# Altium schematic sheet CorePad-V2.0.SchDoc
size A2
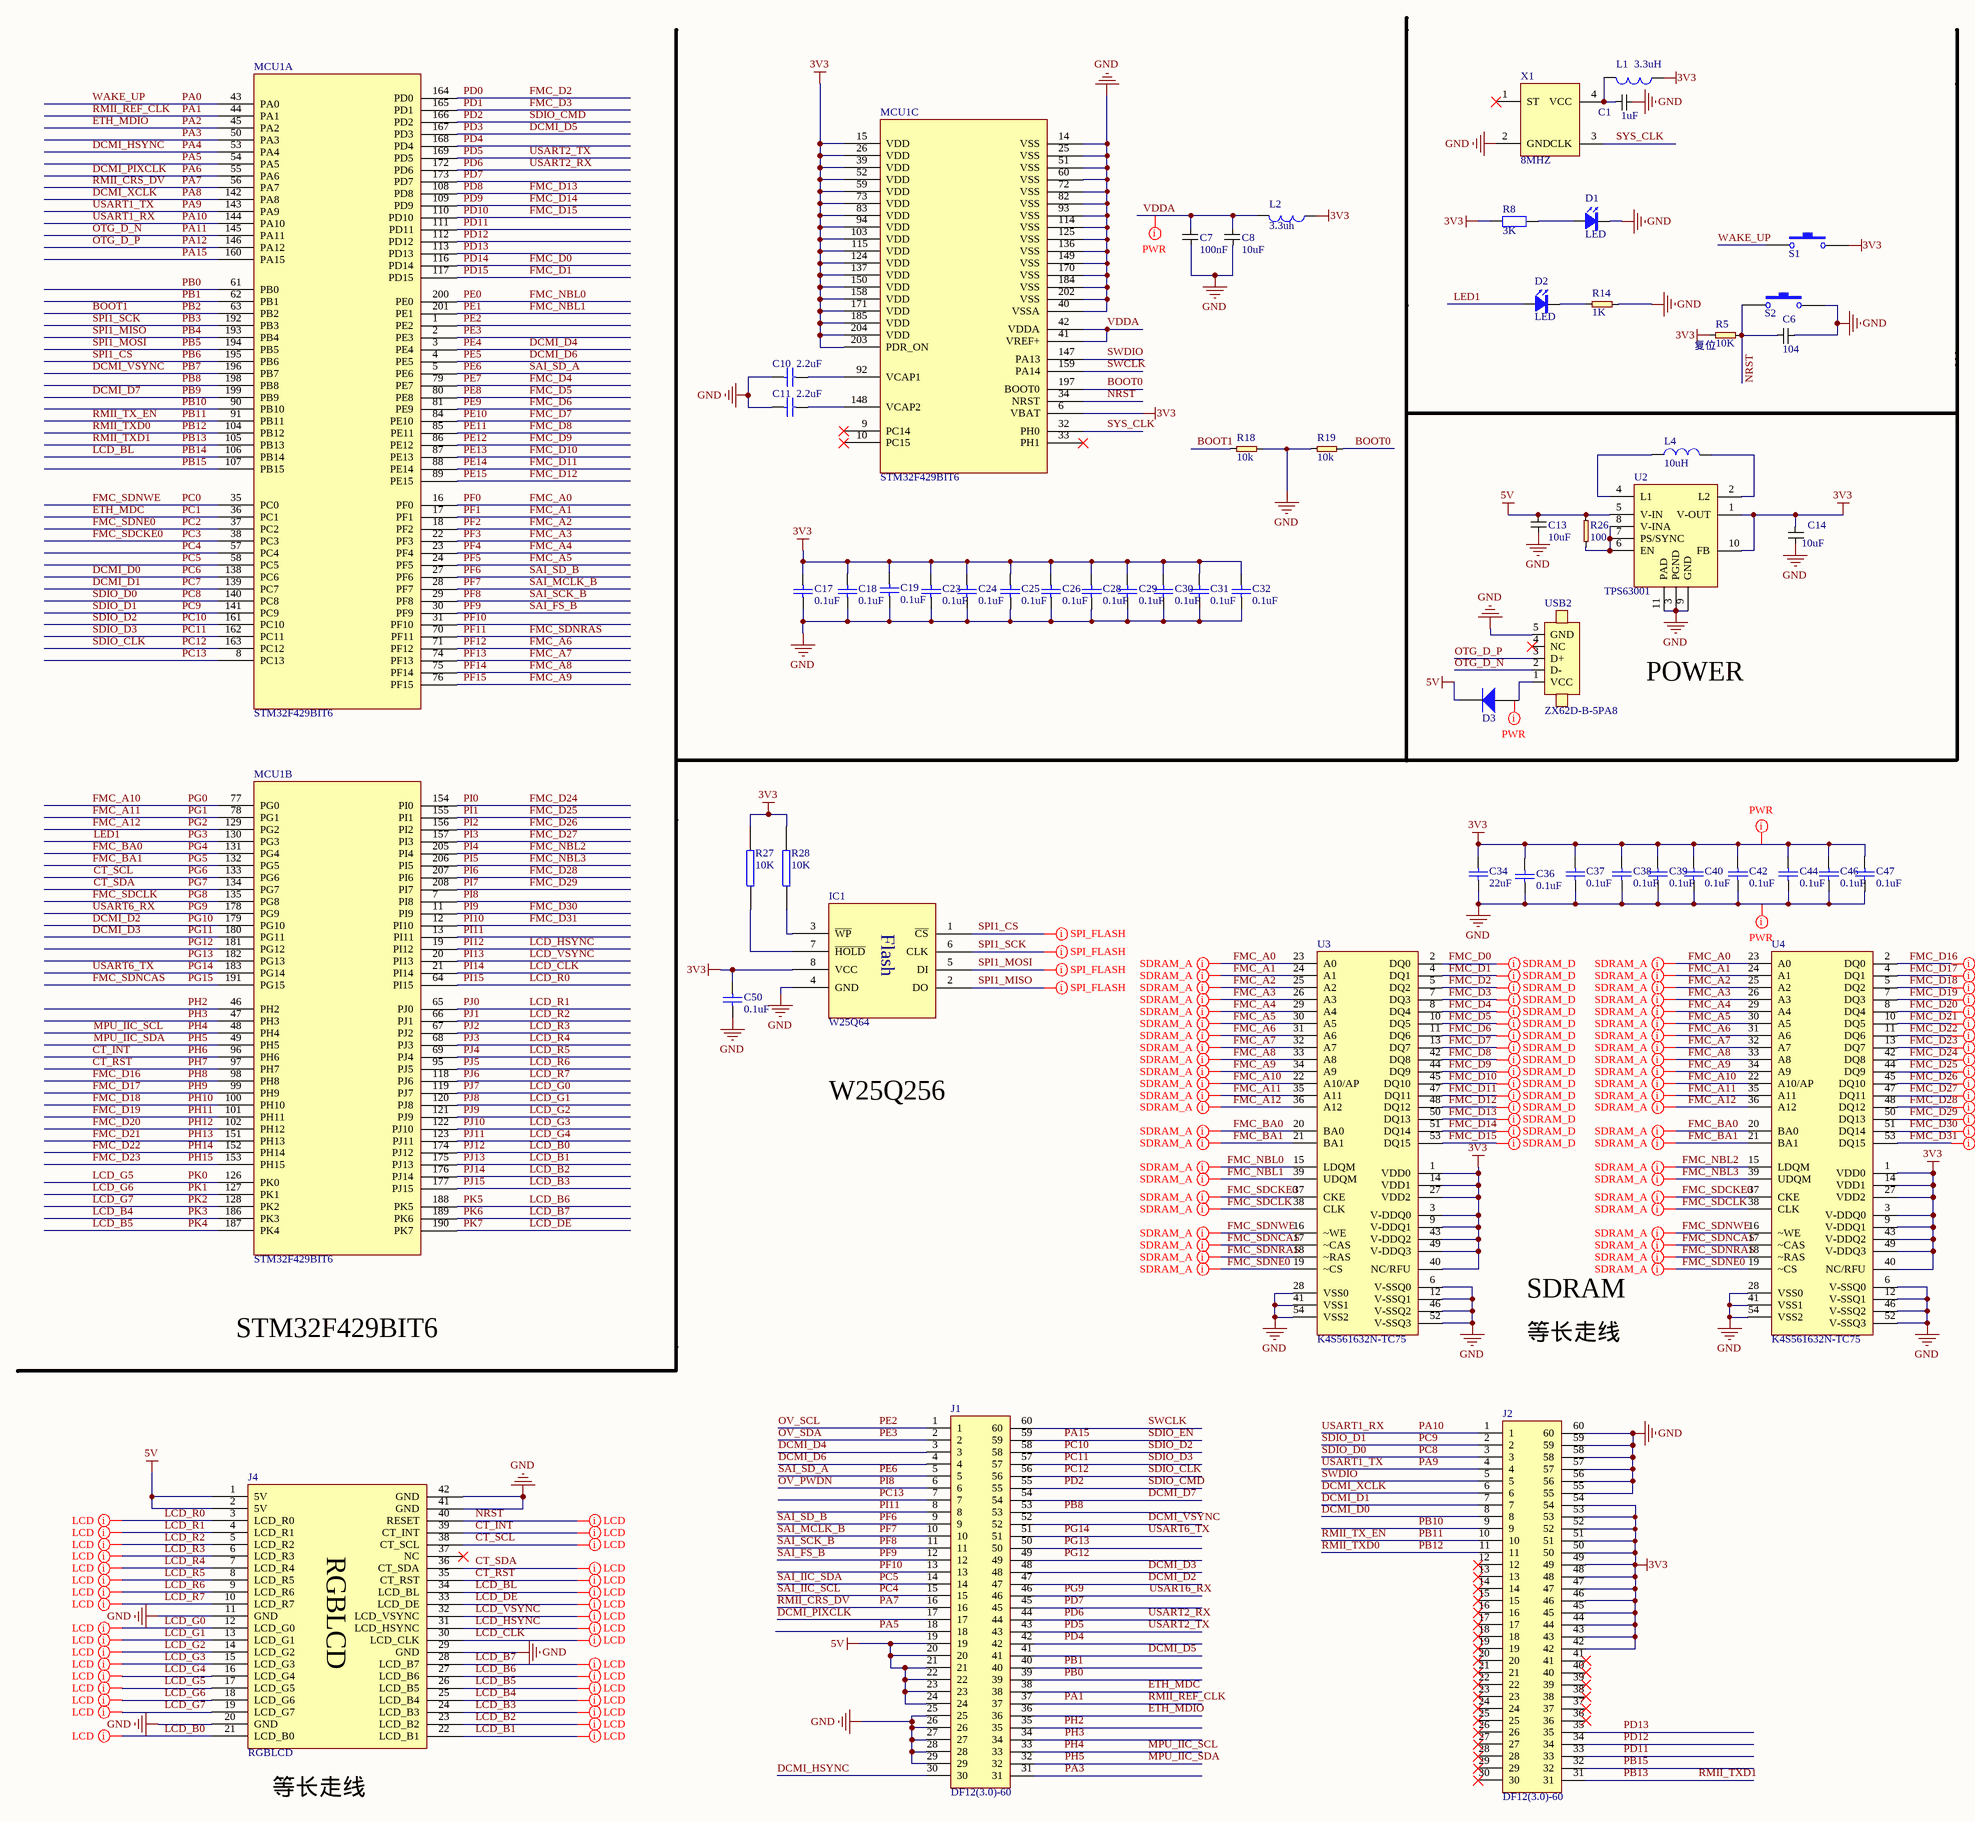
[diagram p0: CorePad-V2.0.SchDoc]

## Parts
C1  1uF  [0603_c]
C6  104  [0603_c]
C7  100nF  [0603_c]
C8  10uF  [0603_c]
C10  2.2uF  [0603_c]
C11  2.2uF  [0603_c]
C13  10uF  [0603_c]
C14  10uF  [0603_c]
C17  0.1uF  [0603_c]
C18  0.1uF  [0603_c]
C19  0.1uF  [0603_c]
C23  0.1uF  [0603_c]
C24  0.1uF  [0603_c]
C25  0.1uF  [0603_c]
C26  0.1uF  [0603_c]
C28  0.1uF  [0603_c]
C29  0.1uF  [0603_c]
C30  0.1uF  [0603_c]
C31  0.1uF  [0603_c]
C32  0.1uF  [0603_c]
C34  22uF  [0603_c]
C36  0.1uF  [0603_c]
C37  0.1uF  [0603_c]
C38  0.1uF  [0603_c]
C39  0.1uF  [0603_c]
C40  0.1uF  [0603_c]
C42  0.1uF  [0603_c]
C44  0.1uF  [0603_c]
C46  0.1uF  [0603_c]
C47  0.1uF  [0603_c]
C50  0.1uF  [0603_c]
D1  LED  [D0603-B]
D2  LED  [D0603-B]
D3  1N5819  [SOD123]  (value not drawn)
IC1  W25Q64  [SOIC-W-8]
J1  DF12(3.0)-60  [DF12(3.0)-60DS]
J2  DF12(3.0)-60  [DF12(3.0)-60DS]
J4  RGBLCD  [FPC_0.5MM_40P]
L1  3.3uH  [0603_R]
L2  3.3uh  [0603_R]
L4  10uH  [L-SMD]
MCU1  STM32F429BIT6  [LQFP-208-0.5MM]  (parts A,B,C of 3)
R5  10K  [0603_R]
R8  3K  [0603_R]
R14  1K  [0603_R]
R18  10k  [0603_R]
R19  10k  [0603_R]
R26  100  [0603_R]
R27  10K  [0603_R]
R28  10K  [0603_R]
S1  SW-PB  [SW-3625]  (value not drawn)
S2  SW-PB  [SW-3625]  (value not drawn)
U2  TPS63001  [QFN-10]
U3  K4S561632N-TC75  [TSOP54]
U4  K4S561632N-TC75  [TSOP54]
USB2  ZX62D-B-5PA8  [Micro_USB]
X1  8MHZ  [OSC]

## Nets
3V3: C14.2 C17.2 C18.2 C19.2 C23.2 C24.2 C25.2 C26.2 C28.2 C29.2 C30.2 C31.2 C32.2 C34.2 C36.2 C37.2 C38.2 C39.2 C40.2 C42.2 C44.2 C46.2 C47.2 C50.2 IC1.8(VCC) J2.42 J2.43 J2.44 J2.45 J2.46 J2.47 J2.48 J2.49 J2.50 J2.51 J2.52 J2.53 J2.54 L1.1 L2.1 MCU1.6(VBAT) MCU1.15(VDD) MCU1.26(VDD) MCU1.39(VDD) MCU1.52(VDD) MCU1.59(VDD) MCU1.73(VDD) MCU1.83(VDD) MCU1.94(VDD) MCU1.103(VDD) MCU1.115(VDD) MCU1.124(VDD) MCU1.137(VDD) MCU1.150(VDD) MCU1.158(VDD) MCU1.171(VDD) MCU1.185(VDD) MCU1.203(PDR_ON) MCU1.204(VDD) R5.1 R8.1 R27.2 R28.2 S1.2 U2.1(V-OUT) U2.10(FB) U3.1(VDD0) U3.3(V-DDQ0) U3.9(V-DDQ1) U3.14(VDD1) U3.27(VDD2) U3.40(NC/RFU) U3.43(V-DDQ2) U3.49(V-DDQ3) U4.1(VDD0) U4.3(V-DDQ0) U4.9(V-DDQ1) U4.14(VDD1) U4.27(VDD2) U4.40(NC/RFU) U4.43(V-DDQ2) U4.49(V-DDQ3)
5V: C13.2 D3.2(N) J1.19 J1.20 J1.21 J1.22 J1.23 J1.24 J4.1(5V) J4.2(5V) R26.2 U2.5(V-IN)
GND: C1.2 C6.2 C7.2 C8.2 C10.1 C11.1 C13.1 C14.1 C17.1 C18.1 C19.1 C23.1 C24.1 C25.1 C26.1 C28.1 C29.1 C30.1 C31.1 C32.1 C34.1 C36.1 C37.1 C38.1 C39.1 C40.1 C42.1 C44.1 C46.1 C47.1 C50.1 D1.K IC1.4(GND) J1.25 J1.26 J1.27 J1.28 J1.29 J2.55 J2.56 J2.57 J2.58 J2.59 J2.60 J4.11(GND) J4.20(GND) J4.29(GND) J4.41(GND) J4.42(GND) MCU1.14(VSS) MCU1.25(VSS) MCU1.40(VSSA) MCU1.51(VSS) MCU1.60(VSS) MCU1.72(VSS) MCU1.82(VSS) MCU1.93(VSS) MCU1.114(VSS) MCU1.125(VSS) MCU1.136(VSS) MCU1.149(VSS) MCU1.170(VSS) MCU1.184(VSS) MCU1.202(VSS) R14.2 R18.2 R19.1 S2.2 U2.3(PGND) U2.9(GND) U2.11(PAD) U3.6(V-SSQ0) U3.12(V-SSQ1) U3.28(VSS0) U3.41(VSS1) U3.46(V-SSQ2) U3.52(V-SSQ3) U3.54(VSS2) U4.6(V-SSQ0) U4.12(V-SSQ1) U4.28(VSS0) U4.41(VSS1) U4.46(V-SSQ2) U4.52(V-SSQ3) U4.54(VSS2) USB2.5(GND) X1.2(GND)
BOOT0: MCU1.197(BOOT0) R19.2
BOOT1: MCU1.63(PB2) R18.1  [also labelled PB2]
CT_INT: J4.39(CT_INT) MCU1.96(PH6)  [also labelled PH6]
CT_RST: J4.35(CT_RST) MCU1.97(PH7)  [also labelled PH7]
CT_SCL: J4.38(CT_SCL) MCU1.133(PG6)  [also labelled PG6]
CT_SDA: J4.36(CT_SDA) MCU1.134(PG7)  [also labelled PG7]
DCMI_D0: J2.8 MCU1.138(PC6)  [also labelled PC6]
DCMI_D1: J2.7 MCU1.139(PC7)  [also labelled PC7]
DCMI_D2: J1.47 MCU1.179(PG10)  [also labelled PG10]
DCMI_D3: J1.48 MCU1.180(PG11)  [also labelled PG11]
DCMI_D4: J1.3 MCU1.3(PE4)  [also labelled PE4]
DCMI_D5: J1.41 MCU1.167(PD3)  [also labelled PD3]
DCMI_D6: J1.4 MCU1.4(PE5)  [also labelled PE5]
DCMI_D7: J1.54 MCU1.199(PB9)  [also labelled PB9]
DCMI_HSYNC: J1.30 MCU1.53(PA4)  [also labelled PA4]
DCMI_PIXCLK: J1.17 MCU1.55(PA6)  [also labelled PA6]
DCMI_VSYNC: J1.52 MCU1.196(PB7)  [also labelled PB7]
DCMI_XCLK: J2.6 MCU1.142(PA8)  [also labelled PA8]
ETH_MDC: J1.38 MCU1.36(PC1)  [also labelled PC1]
ETH_MDIO: J1.36 MCU1.45(PA2)  [also labelled PA2]
FMC_A0: MCU1.16(PF0) U3.23(A0) U4.23(A0)  [also labelled PF0]
FMC_A1: MCU1.17(PF1) U3.24(A1) U4.24(A1)  [also labelled PF1]
FMC_A2: MCU1.18(PF2) U3.25(A2) U4.25(A2)  [also labelled PF2]
FMC_A3: MCU1.22(PF3) U3.26(A3) U4.26(A3)  [also labelled PF3]
FMC_A4: MCU1.23(PF4) U3.29(A4) U4.29(A4)  [also labelled PF4]
FMC_A5: MCU1.24(PF5) U3.30(A5) U4.30(A5)  [also labelled PF5]
FMC_A6: MCU1.71(PF12) U3.31(A6) U4.31(A6)  [also labelled PF12]
FMC_A7: MCU1.74(PF13) U3.32(A7) U4.32(A7)  [also labelled PF13]
FMC_A8: MCU1.75(PF14) U3.33(A8) U4.33(A8)  [also labelled PF14]
FMC_A9: MCU1.76(PF15) U3.34(A9) U4.34(A9)  [also labelled PF15]
FMC_A10: MCU1.77(PG0) U3.22(A10/AP) U4.22(A10/AP)  [also labelled PG0]
FMC_A11: MCU1.78(PG1) U3.35(A11) U4.35(A11)  [also labelled PG1]
FMC_A12: MCU1.129(PG2) U3.36(A12) U4.36(A12)  [also labelled PG2]
FMC_BA0: MCU1.131(PG4) U3.20(BA0) U4.20(BA0)  [also labelled PG4]
FMC_BA1: MCU1.132(PG5) U3.21(BA1) U4.21(BA1)  [also labelled PG5]
FMC_D0: MCU1.116(PD14) U3.2(DQ0)  [also labelled PD14]
FMC_D1: MCU1.117(PD15) U3.4(DQ1)  [also labelled PD15]
FMC_D2: MCU1.164(PD0) U3.5(DQ2)  [also labelled PD0]
FMC_D3: MCU1.165(PD1) U3.7(DQ3)  [also labelled PD1]
FMC_D4: MCU1.79(PE7) U3.8(DQ4)  [also labelled PE7]
FMC_D5: MCU1.80(PE8) U3.10(DQ5)  [also labelled PE8]
FMC_D6: MCU1.81(PE9) U3.11(DQ6)  [also labelled PE9]
FMC_D7: MCU1.84(PE10) U3.13(DQ7)  [also labelled PE10]
FMC_D8: MCU1.85(PE11) U3.42(DQ8)  [also labelled PE11]
FMC_D9: MCU1.86(PE12) U3.44(DQ9)  [also labelled PE12]
FMC_D10: MCU1.87(PE13) U3.45(DQ10)  [also labelled PE13]
FMC_D11: MCU1.88(PE14) U3.47(DQ11)  [also labelled PE14]
FMC_D12: MCU1.89(PE15) U3.48(DQ12)  [also labelled PE15]
FMC_D13: MCU1.108(PD8) U3.50(DQ13)  [also labelled PD8]
FMC_D14: MCU1.109(PD9) U3.51(DQ14)  [also labelled PD9]
FMC_D15: MCU1.110(PD10) U3.53(DQ15)  [also labelled PD10]
FMC_D16: MCU1.98(PH8) U4.2(DQ0)  [also labelled PH8]
FMC_D17: MCU1.99(PH9) U4.4(DQ1)  [also labelled PH9]
FMC_D18: MCU1.100(PH10) U4.5(DQ2)  [also labelled PH10]
FMC_D19: MCU1.101(PH11) U4.7(DQ3)  [also labelled PH11]
FMC_D20: MCU1.102(PH12) U4.8(DQ4)  [also labelled PH12]
FMC_D21: MCU1.151(PH13) U4.10(DQ5)  [also labelled PH13]
FMC_D22: MCU1.152(PH14) U4.11(DQ6)  [also labelled PH14]
FMC_D23: MCU1.153(PH15) U4.13(DQ7)  [also labelled PH15]
FMC_D24: MCU1.154(PI0) U4.42(DQ8)  [also labelled PI0]
FMC_D25: MCU1.155(PI1) U4.44(DQ9)  [also labelled PI1]
FMC_D26: MCU1.156(PI2) U4.45(DQ10)  [also labelled PI2]
FMC_D27: MCU1.157(PI3) U4.47(DQ11)  [also labelled PI3]
FMC_D28: MCU1.207(PI6) U4.48(DQ12)  [also labelled PI6]
FMC_D29: MCU1.208(PI7) U4.50(DQ13)  [also labelled PI7]
FMC_D30: MCU1.11(PI9) U4.51(DQ14)  [also labelled PI9]
FMC_D31: MCU1.12(PI10) U4.53(DQ15)  [also labelled PI10]
FMC_NBL0: MCU1.200(PE0) U3.15(LDQM)  [also labelled PE0]
FMC_NBL1: MCU1.201(PE1) U3.39(UDQM)  [also labelled PE1]
FMC_NBL2: MCU1.205(PI4) U4.15(LDQM)  [also labelled PI4]
FMC_NBL3: MCU1.206(PI5) U4.39(UDQM)  [also labelled PI5]
FMC_SDCKE0: MCU1.38(PC3) U3.37(CKE) U4.37(CKE)  [also labelled PC3]
FMC_SDCLK: MCU1.135(PG8) U3.38(CLK) U4.38(CLK)  [also labelled PG8]
FMC_SDNCAS: MCU1.191(PG15) U3.17(~CAS) U4.17(~CAS)  [also labelled PG15]
FMC_SDNE0: MCU1.37(PC2) U3.19(~CS) U4.19(~CS)  [also labelled PC2]
FMC_SDNRAS: MCU1.70(PF11) U3.18(~RAS) U4.18(~RAS)  [also labelled PF11]
FMC_SDNWE: MCU1.35(PC0) U3.16(~WE) U4.16(~WE)  [also labelled PC0]
LCD_B0: J4.21(LCD_B0) MCU1.174(PJ12)  [also labelled PJ12]
LCD_B1: J4.22(LCD_B1) MCU1.175(PJ13)  [also labelled PJ13]
LCD_B2: J4.23(LCD_B2) MCU1.176(PJ14)  [also labelled PJ14]
LCD_B3: J4.24(LCD_B3) MCU1.177(PJ15)  [also labelled PJ15]
LCD_B4: J4.25(LCD_B4) MCU1.186(PK3)  [also labelled PK3]
LCD_B5: J4.26(LCD_B5) MCU1.187(PK4)  [also labelled PK4]
LCD_B6: J4.27(LCD_B6) MCU1.188(PK5)  [also labelled PK5]
LCD_B7: J4.28(LCD_B7) MCU1.189(PK6)  [also labelled PK6]
LCD_BL: J4.34(LCD_BL) MCU1.106(PB14)  [also labelled PB14]
LCD_CLK: J4.30(LCD_CLK) MCU1.21(PI14)  [also labelled PI14]
LCD_DE: J4.33(LCD_DE) MCU1.190(PK7)  [also labelled PK7]
LCD_G0: J4.12(LCD_G0) MCU1.119(PJ7)  [also labelled PJ7]
LCD_G1: J4.13(LCD_G1) MCU1.120(PJ8)  [also labelled PJ8]
LCD_G2: J4.14(LCD_G2) MCU1.121(PJ9)  [also labelled PJ9]
LCD_G3: J4.15(LCD_G3) MCU1.122(PJ10)  [also labelled PJ10]
LCD_G4: J4.16(LCD_G4) MCU1.123(PJ11)  [also labelled PJ11]
LCD_G5: J4.17(LCD_G5) MCU1.126(PK0)  [also labelled PK0]
LCD_G6: J4.18(LCD_G6) MCU1.127(PK1)  [also labelled PK1]
LCD_G7: J4.19(LCD_G7) MCU1.128(PK2)  [also labelled PK2]
LCD_HSYNC: J4.31(LCD_HSYNC) MCU1.19(PI12)  [also labelled PI12]
LCD_R0: J4.3(LCD_R0) MCU1.64(PI15)  [also labelled PI15]
LCD_R1: J4.4(LCD_R1) MCU1.65(PJ0)  [also labelled PJ0]
LCD_R2: J4.5(LCD_R2) MCU1.66(PJ1)  [also labelled PJ1]
LCD_R3: J4.6(LCD_R3) MCU1.67(PJ2)  [also labelled PJ2]
LCD_R4: J4.7(LCD_R4) MCU1.68(PJ3)  [also labelled PJ3]
LCD_R5: J4.8(LCD_R5) MCU1.69(PJ4)  [also labelled PJ4]
LCD_R6: J4.9(LCD_R6) MCU1.95(PJ5)  [also labelled PJ5]
LCD_R7: J4.10(LCD_R7) MCU1.118(PJ6)  [also labelled PJ6]
LCD_VSYNC: J4.32(LCD_VSYNC) MCU1.20(PI13)  [also labelled PI13]
LED1: D2.A MCU1.130(PG3)  [also labelled PG3]
MPU_IIC_SCL: J1.33 MCU1.48(PH4)  [also labelled PH4]
MPU_IIC_SDA: J1.32 MCU1.49(PH5)  [also labelled PH5]
NRST: C6.1 J4.40(RESET) MCU1.34(NRST) R5.2 S2.1
OTG_D_N: MCU1.145(PA11) USB2.2(D-)  [also labelled PA11]
OTG_D_P: MCU1.146(PA12) USB2.3(D+)  [also labelled PA12]
OV_PWDN: J1.6 MCU1.7(PI8)  [also labelled PI8]
OV_SCL: J1.1 MCU1.1(PE2)  [also labelled PE2]
OV_SDA: J1.2 MCU1.2(PE3)  [also labelled PE3]
PA0: MCU1.43(PA0) S1.1  [also labelled WAKE_UP]
PA1: J1.37 MCU1.44(PA1)  [also labelled RMII_REF_CLK]
PA3: J1.31 MCU1.50(PA3)
PA5: J1.18 MCU1.54(PA5)
PA7: J1.16 MCU1.56(PA7)  [also labelled RMII_CRS_DV]
PA9: J2.4 MCU1.143(PA9)  [also labelled USART1_TX]
PA10: J2.1 MCU1.144(PA10)  [also labelled USART1_RX]
PA15: J1.59 MCU1.160(PA15)  [also labelled SDIO_EN]
PB0: J1.39 MCU1.61(PB0)
PB1: J1.40 MCU1.62(PB1)
PB3: IC1.6(CLK) MCU1.192(PB3)  [also labelled SPI1_SCK]
PB4: IC1.2(DO) MCU1.193(PB4)  [also labelled SPI1_MISO]
PB5: IC1.5(DI) MCU1.194(PB5)  [also labelled SPI1_MOSI]
PB6: IC1.1(~{CS}) MCU1.195(PB6)  [also labelled SPI1_CS]
PB8: J1.53 MCU1.198(PB8)
PB10: J2.9 MCU1.90(PB10)
PB11: J2.10 MCU1.91(PB11)  [also labelled RMII_TX_EN]
PB12: J2.11 MCU1.104(PB12)  [also labelled RMII_TXD0]
PB13: J2.31 MCU1.105(PB13)  [also labelled RMII_TXD1]
PB15: J2.32 MCU1.107(PB15)
PC4: J1.15 MCU1.57(PC4)  [also labelled SAI_IIC_SCL]
PC5: J1.14 MCU1.58(PC5)  [also labelled SAI_IIC_SDA]
PC8: J2.3 MCU1.140(PC8)  [also labelled SDIO_D0]
PC9: J2.2 MCU1.141(PC9)  [also labelled SDIO_D1]
PC10: J1.58 MCU1.161(PC10)  [also labelled SDIO_D2]
PC11: J1.57 MCU1.162(PC11)  [also labelled SDIO_D3]
PC12: J1.56 MCU1.163(PC12)  [also labelled SDIO_CLK]
PC13: J1.7 MCU1.8(PC13)
PD2: J1.55 MCU1.166(PD2)  [also labelled SDIO_CMD]
PD4: J1.42 MCU1.168(PD4)
PD5: J1.43 MCU1.169(PD5)  [also labelled USART2_TX]
PD6: J1.44 MCU1.172(PD6)  [also labelled USART2_RX]
PD7: J1.45 MCU1.173(PD7)
PD11: J2.33 MCU1.111(PD11)
PD12: J2.34 MCU1.112(PD12)
PD13: J2.35 MCU1.113(PD13)
PE6: J1.5 MCU1.5(PE6)  [also labelled SAI_SD_A]
PF6: J1.9 MCU1.27(PF6)  [also labelled SAI_SD_B]
PF7: J1.10 MCU1.28(PF7)  [also labelled SAI_MCLK_B]
PF8: J1.11 MCU1.29(PF8)  [also labelled SAI_SCK_B]
PF9: J1.12 MCU1.30(PF9)  [also labelled SAI_FS_B]
PF10: J1.13 MCU1.31(PF10)
PG9: J1.46 MCU1.178(PG9)  [also labelled USART6_RX]
PG12: J1.49 MCU1.181(PG12)
PG13: J1.50 MCU1.182(PG13)
PG14: J1.51 MCU1.183(PG14)  [also labelled USART6_TX]
PH2: J1.35 MCU1.46(PH2)
PH3: J1.34 MCU1.47(PH3)
PI11: J1.8 MCU1.13(PI11)
SWCLK: J1.60 MCU1.159(PA14)
SWDIO: J2.5 MCU1.147(PA13)
SYS_CLK: MCU1.32(PH0) X1.3(CLK)
VDDA: C7.1 C8.1 L2.2 MCU1.41(VREF+) MCU1.42(VDDA)
NetC1_1: C1.1 L1.2 X1.4(VCC)
NetC10_2: C10.2 MCU1.92(VCAP1)
NetC11_2: C11.2 MCU1.148(VCAP2)
NetD1_A: D1.A R8.2
NetD2_K: D2.K R14.1
NetD3_1: D3.1(P) USB2.1(VCC)
NetIC1_3: IC1.3(~{WP}) R28.1
NetIC1_7: IC1.7(~{HOLD}) R27.1
NetL4_1: L4.1 U2.4(L1)
NetL4_2: L4.2 U2.2(L2)
NetR26_1: R26.1 U2.6(EN) U2.7(PS/SYNC) U2.8(V-INA)

Not connected (* = marked no-connect by the designer): J2 12* 13* 14* 15* 16* 17* 18* 19* 20* 21* 22* 23* 24* 25* 26* 27* 28* 29* 30* 36* 37* 38* 39* 40* 41*; J4 37(NC)*; MCU1 9(PC14)* 10(PC15)* 33(PH1)*; USB2 4(NC)*; X1 1(ST)*

## Layout directives
net class SPI_FLASH: PB3, PB4, PB5, PB6
net class LCD: CT_INT, CT_RST, CT_SCL, CT_SDA, LCD_B0, LCD_B1, LCD_B2, LCD_B3, LCD_B4, LCD_B5, LCD_B6, LCD_B7, LCD_BL, LCD_CLK, LCD_DE, LCD_G0, LCD_G1, LCD_G2, LCD_G3, LCD_G4, LCD_G5, LCD_G6, LCD_G7, LCD_HSYNC, LCD_R0, LCD_R1, LCD_R2, LCD_R3, LCD_R4, LCD_R5, LCD_R6, LCD_R7, LCD_VSYNC, NRST
net class PWR: 3V3, (no net found under the mark), GND, VDDA
net class SDRAM_A: FMC_A0, FMC_A1, FMC_A2, FMC_A3, FMC_A4, FMC_A5, FMC_A6, FMC_A7, FMC_A8, FMC_A9, FMC_A10, FMC_A11, FMC_A12, FMC_BA0, FMC_BA1, FMC_NBL0, FMC_NBL1, FMC_NBL2, FMC_NBL3, FMC_SDCKE0, FMC_SDCLK, FMC_SDNCAS, FMC_SDNE0, FMC_SDNRAS, FMC_SDNWE
net class SDRAM_D: FMC_D0, FMC_D1, FMC_D2, FMC_D3, FMC_D4, FMC_D5, FMC_D6, FMC_D7, FMC_D8, FMC_D9, FMC_D10, FMC_D11, FMC_D12, FMC_D13, FMC_D14, FMC_D15, FMC_D16, FMC_D17, FMC_D18, FMC_D19, FMC_D20, FMC_D21, FMC_D22, FMC_D23, FMC_D24, FMC_D25, FMC_D26, FMC_D27, FMC_D28, FMC_D29, FMC_D30, FMC_D31

## Notes on the sheet
- (near R5) 复位
- POWER
- W25Q256
- SDRAM
- STM32F429BIT6
- 等长走线
- (near J4) 等长走线
- (in symbol W25QXX) Flash

## Library data of the parts
C1 C6-C8 C13 C14 = C
C10 C11 C17-C19 C23-C26 C28-C32 C34 C36-C40 C42 C44 C46 C47 C50 = Cap1
  C10 C11: value: 2.2uF
  C17-C19 C23-C26 C28-C32 C36-C40 C42 C44 C46 C47 C50: value: 0.1uF
  C34: value: 22uF
D3 = D
IC1 = W25QXX
L1 L2 L4 = Inductor
R5 R14 R18 R19 R26 = R
R8 = Res: value: 3K
R27 R28 = RES
U2 = TPS63001: DC-DC 3.3V输出
USB2 = micro usb
X1 = OSC